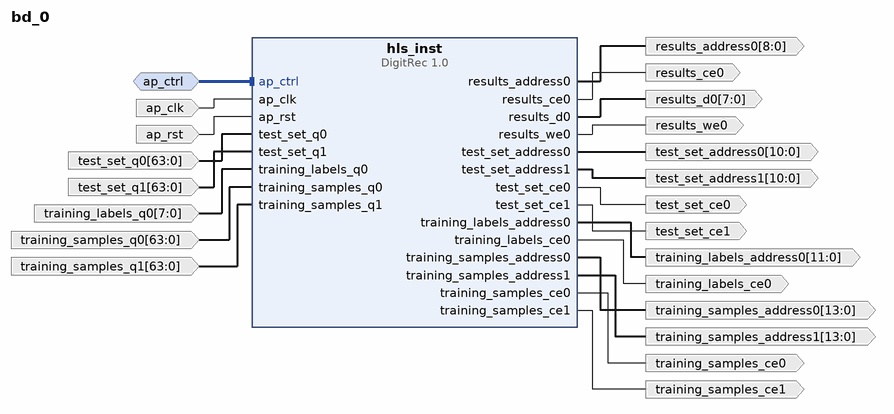
[diagram p0: block diagram of the top level]
# Vivado block design bd_0, xc7z020clg400-1, Vivado 2023.2
create_bd_design bd_0

create_bd_intf_port -mode Slave -vlnv xilinx.com:interface:acc_handshake_rtl:1.0 ap_ctrl
create_bd_port -dir I -type clk ap_clk
set_property -dict {CONFIG.FREQ_HZ 200000000.0} [get_bd_ports ap_clk]
create_bd_port -dir I -type rst ap_rst
set_property -dict {CONFIG.POLARITY ACTIVE_HIGH} [get_bd_ports ap_rst]
create_bd_port -dir O -from 8 -to 0 -type data results_address0
create_bd_port -dir O results_ce0
create_bd_port -dir O -from 7 -to 0 -type data results_d0
create_bd_port -dir O results_we0
create_bd_port -dir O -from 10 -to 0 -type data test_set_address0
create_bd_port -dir O -from 10 -to 0 -type data test_set_address1
create_bd_port -dir O test_set_ce0
create_bd_port -dir O test_set_ce1
create_bd_port -dir I -from 63 -to 0 -type data test_set_q0
create_bd_port -dir I -from 63 -to 0 -type data test_set_q1
create_bd_port -dir O -from 11 -to 0 -type data training_labels_address0
create_bd_port -dir O training_labels_ce0
create_bd_port -dir I -from 7 -to 0 -type data training_labels_q0
create_bd_port -dir O -from 13 -to 0 -type data training_samples_address0
create_bd_port -dir O -from 13 -to 0 -type data training_samples_address1
create_bd_port -dir O training_samples_ce0
create_bd_port -dir O training_samples_ce1
create_bd_port -dir I -from 63 -to 0 -type data training_samples_q0
create_bd_port -dir I -from 63 -to 0 -type data training_samples_q1

create_bd_cell -type ip -vlnv xilinx.com:hls:DigitRec:1.0 hls_inst

# ---- connections ----

connect_bd_intf_net -intf_net ap_ctrl_0_1 [get_bd_intf_ports ap_ctrl] [get_bd_intf_pins hls_inst/ap_ctrl]
connect_bd_net -net ap_clk_0_1 [get_bd_ports ap_clk] [get_bd_pins hls_inst/ap_clk]
connect_bd_net -net ap_rst_0_1 [get_bd_ports ap_rst] [get_bd_pins hls_inst/ap_rst]
connect_bd_net [get_bd_pins hls_inst/results_address0] [get_bd_ports results_address0]
connect_bd_net [get_bd_pins hls_inst/results_ce0] [get_bd_ports results_ce0]
connect_bd_net [get_bd_pins hls_inst/results_d0] [get_bd_ports results_d0]
connect_bd_net [get_bd_pins hls_inst/results_we0] [get_bd_ports results_we0]
connect_bd_net [get_bd_pins hls_inst/test_set_address0] [get_bd_ports test_set_address0]
connect_bd_net [get_bd_pins hls_inst/test_set_address1] [get_bd_ports test_set_address1]
connect_bd_net [get_bd_pins hls_inst/test_set_ce0] [get_bd_ports test_set_ce0]
connect_bd_net [get_bd_pins hls_inst/test_set_ce1] [get_bd_ports test_set_ce1]
connect_bd_net [get_bd_pins hls_inst/training_labels_address0] [get_bd_ports training_labels_address0]
connect_bd_net [get_bd_pins hls_inst/training_labels_ce0] [get_bd_ports training_labels_ce0]
connect_bd_net [get_bd_pins hls_inst/training_samples_address0] [get_bd_ports training_samples_address0]
connect_bd_net [get_bd_pins hls_inst/training_samples_address1] [get_bd_ports training_samples_address1]
connect_bd_net [get_bd_pins hls_inst/training_samples_ce0] [get_bd_ports training_samples_ce0]
connect_bd_net [get_bd_pins hls_inst/training_samples_ce1] [get_bd_ports training_samples_ce1]
connect_bd_net -net test_set_q0_0_1 [get_bd_ports test_set_q0] [get_bd_pins hls_inst/test_set_q0]
connect_bd_net -net test_set_q1_0_1 [get_bd_ports test_set_q1] [get_bd_pins hls_inst/test_set_q1]
connect_bd_net -net training_labels_q0_0_1 [get_bd_ports training_labels_q0] [get_bd_pins hls_inst/training_labels_q0]
connect_bd_net -net training_samples_q0_0_1 [get_bd_ports training_samples_q0] [get_bd_pins hls_inst/training_samples_q0]
connect_bd_net -net training_samples_q1_0_1 [get_bd_ports training_samples_q1] [get_bd_pins hls_inst/training_samples_q1]

validate_bd_design
save_bd_design
